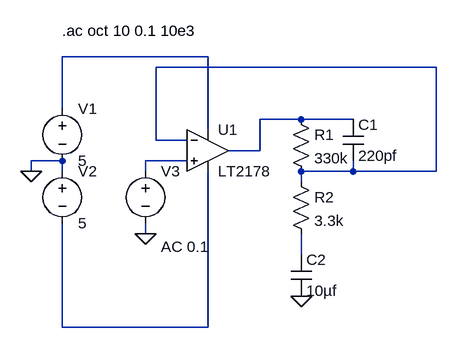
[diagram p0: schematic MAX4208.asc]
MAX4208.asc, the LTspice schematic file:
Version 4
SHEET 1 880 680
WIRE 144 16 -80 16
WIRE 496 32 64 32
WIRE -80 96 -80 16
WIRE 288 112 224 112
WIRE 368 112 288 112
WIRE 144 128 144 16
WIRE 64 144 64 32
WIRE 112 144 64 144
WIRE 224 160 224 112
WIRE 224 160 176 160
WIRE -80 176 -128 176
WIRE 112 176 48 176
WIRE -128 192 -128 176
WIRE -80 192 -80 176
WIRE 48 192 48 176
WIRE 368 192 368 176
WIRE 368 192 288 192
WIRE 496 192 496 32
WIRE 496 192 368 192
WIRE 288 208 288 192
WIRE 48 288 48 272
WIRE 288 320 288 288
WIRE -80 432 -80 272
WIRE 144 432 144 192
WIRE 144 432 -80 432
FLAG -128 192 0
FLAG 48 288 0
FLAG 288 384 0
SYMBOL Opamps\\LT2178 144 96 R0
SYMATTR InstName U1
SYMBOL voltage -80 80 R0
WINDOW 123 0 0 Left 0
WINDOW 39 0 0 Left 0
SYMATTR InstName V1
SYMATTR Value 5
SYMBOL voltage -80 176 R0
WINDOW 123 0 0 Left 0
WINDOW 39 0 0 Left 0
SYMATTR InstName V2
SYMATTR Value 5
SYMBOL voltage 48 176 R0
WINDOW 123 24 132 Left 0
WINDOW 39 0 0 Left 0
SYMATTR InstName V3
SYMATTR Value ""
SYMATTR Value2 AC 0.1
SYMBOL res 272 96 R0
SYMATTR InstName R1
SYMATTR Value 330k
SYMBOL res 272 192 R0
SYMATTR InstName R2
SYMATTR Value 3.3k
SYMBOL cap 352 112 R0
SYMATTR InstName C1
SYMATTR Value 220pf
SYMBOL cap 272 320 R0
SYMATTR InstName C2
SYMATTR Value 10µf
TEXT -80 -24 Left 0 !.ac oct 10 0.1 10e3

The netlist it stands for:
* MAX4208.asc
XU1 N004 N002 N001 N006 N003 LT2178  ; pins In+ In- V+ V- OUT
V1 N001 0 5
V2 0 N006 5
V3 N004 0 AC 0.1
R1 N003 N002 330k
R2 N002 N005 3.3k
C1 N003 N002 220pf
C2 N005 0 10µf
.ac oct 10 0.1 10e3
.backanno
.end